# EAGLE design gatorstepper (EAGLE 7.2.0)
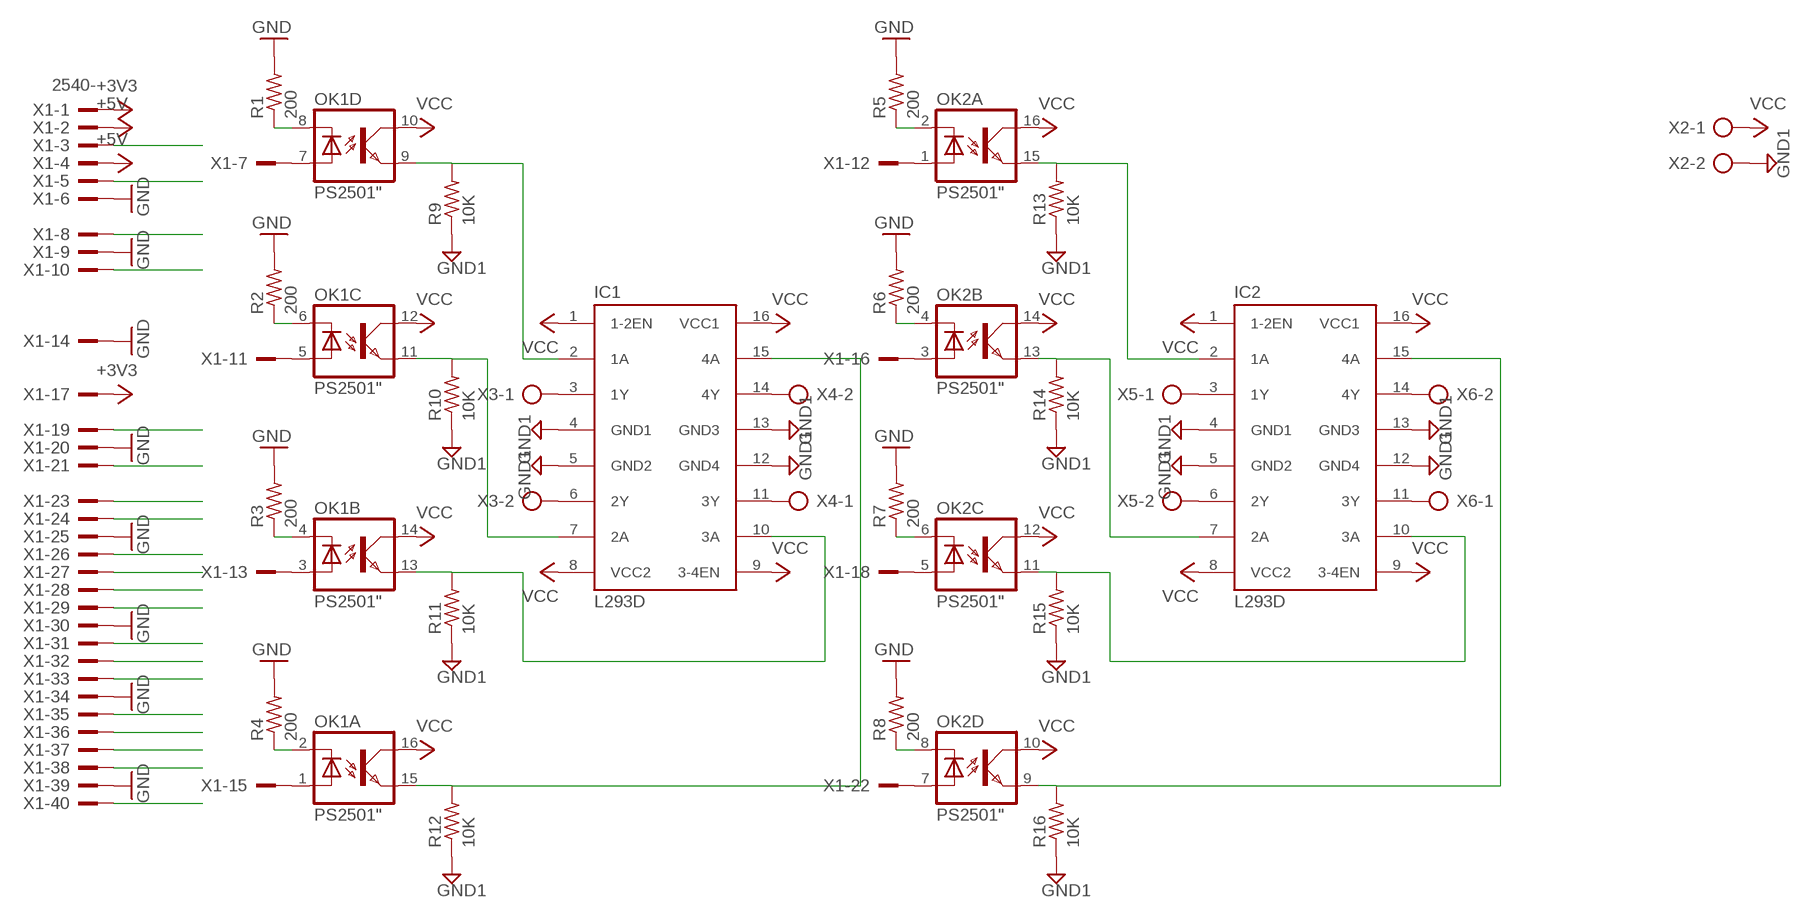
[diagram p0: schematic, sheet 1]

## Parts
IC1  L293D  [DIL16]
IC2  L293D  [DIL16]
OK1  PS2501"  [DIL16]
OK2  PS2501"  [DIL16]
R1  200  R-US_0207/12  [0207/12]
R2  200  R-US_0207/12  [0207/12]
R3  200  R-US_0207/12  [0207/12]
R4  200  R-US_0207/12  [0207/12]
R5  200  R-US_0207/12  [0207/12]
R6  200  R-US_0207/12  [0207/12]
R7  200  R-US_0207/12  [0207/12]
R8  200  R-US_0207/12  [0207/12]
R9  10K  R-US_0207/12  [0207/12]
R10  10K  R-US_0207/12  [0207/12]
R11  10K  R-US_0207/12  [0207/12]
R12  10K  R-US_0207/12  [0207/12]
R13  10K  R-US_0207/12  [0207/12]
R14  10K  R-US_0207/12  [0207/12]
R15  10K  R-US_0207/12  [0207/12]
R16  10K  R-US_0207/12  [0207/12]
X1  2540-  [PAK100/2500-40]
X2  AK300/2  [AK300/2]
X3  AK300/2  [AK300/2]
X4  AK300/2  [AK300/2]
X5  AK300/2  [AK300/2]
X6  AK300/2  [AK300/2]

## Nets
+3V3: X1.1 X1.17
+5V: X1.2 X1.4
GND: R1.2 R2.2 R3.2 R4.2 R5.2 R6.2 R7.2 R8.2 X1.6 X1.9 X1.14 X1.20 X1.25 X1.30 X1.34 X1.39
GND1: IC1.4(GND1) IC1.5(GND2) IC1.12(GND4) IC1.13(GND3) IC2.4(GND1) IC2.5(GND2) IC2.12(GND4) IC2.13(GND3) R9.1 R10.1 R11.1 R12.1 R13.1 R14.1 R15.1 R16.1 X2.2
GPIO5: X1.29
GPIO6: X1.31
GPIO12: X1.32
GPIO13: X1.33
GPIO16: X1.36
GPIO19: X1.35
GPIO20: X1.38
GPIO21: X1.40
GPIO26: X1.37
N$1: OK1.8(D:C) R1.1
N$2: OK1.6(C:C) R2.1
N$3: OK1.4(B:C) R3.1
N$4: OK1.2(A:C) R4.1
N$5: OK2.2(A:C) R5.1
N$6: OK2.4(B:C) R6.1
N$7: OK2.6(C:C) R7.1
N$8: OK2.8(D:C) R8.1
N$9: X1.3
N$10: X1.5
N$11: X1.8
N$12: X1.10
N$13: X1.19
N$14: X1.21
N$15: X1.23
N$16: X1.24
N$17: X1.26
N$18: X1.27
N$19: X1.28
N$20: IC1.2(1A) OK1.9(D:EMI) R9.2
N$21: IC1.7(2A) OK1.11(C:EMI) R10.2
N$22: IC1.10(3A) OK1.13(B:EMI) R11.2
N$23: IC1.15(4A) OK1.15(A:EMI) R12.2
N$24: IC2.2(1A) OK2.15(A:EMI) R13.2
N$25: IC2.7(2A) OK2.13(B:EMI) R14.2
N$26: IC2.10(3A) OK2.11(C:EMI) R15.2
N$27: IC2.15(4A) OK2.9(D:EMI) R16.2
N$28: IC1.3(1Y) X3.1
N$29: IC1.6(2Y) X3.2
N$30: IC1.14(4Y) X4.2
N$31: IC1.11(3Y) X4.1
N$32: IC2.3(1Y) X5.1
N$33: IC2.6(2Y) X5.2
N$34: IC2.11(3Y) X6.1
N$35: IC2.14(4Y) X6.2
N$36: OK1.1(A:A) X1.15
N$37: OK2.1(A:A) X1.12
N$38: OK2.3(B:A) X1.16
N$39: OK2.5(C:A) X1.18
N$40: OK2.7(D:A) X1.22
N$41: OK1.3(B:A) X1.13
N$42: OK1.5(C:A) X1.11
N$43: OK1.7(D:A) X1.7
VCC: IC1.1(1-2EN) IC1.8(VCC2) IC1.9(3-4EN) IC1.16(VCC1) IC2.1(1-2EN) IC2.8(VCC2) IC2.9(3-4EN) IC2.16(VCC1) OK1.10(D:COL) OK1.12(C:COL) OK1.14(B:COL) OK1.16(A:COL) OK2.10(D:COL) OK2.12(C:COL) OK2.14(B:COL) OK2.16(A:COL) X2.1

## Library data of the parts
IC1 IC2 = st-microelectronics:L293D: PUSH-PULL 4 CHANNEL DRIVER; MPN: L293D; OC_FARNELL: 9589619; OC_NEWARK: 56P8249
OK1 OK2 = optocoupler:PS2501: SHARP OPTO COUPLER
R1-R16 = resistor:R-US_: RESISTOR, American symbol
X1 = con-3m:2540-: 3M (TM) Pak 100 4-Wall Header Source: 3M; OC_FARNELL: unknown; OC_NEWARK: unknown
X2-X6 = con-ptr500:AK300/2: CONNECTOR; OC_FARNELL: unknown; OC_NEWARK: unknown

## Board
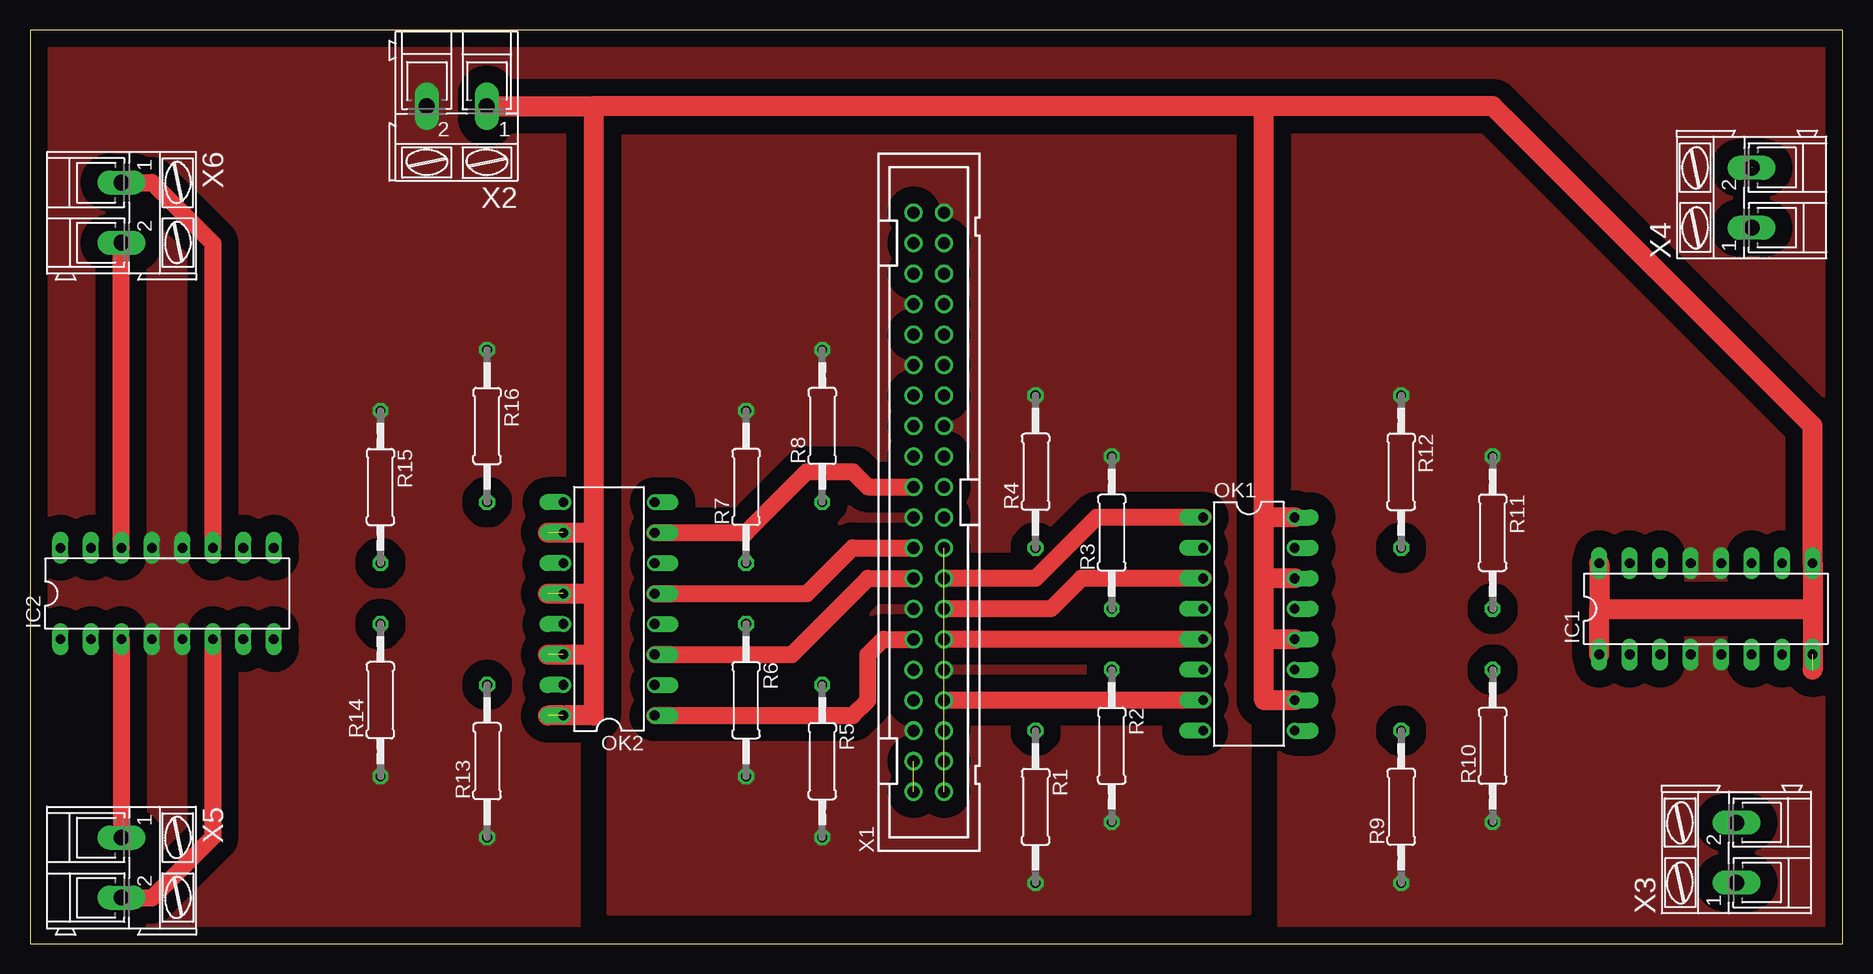
[diagram p1: board, top side]
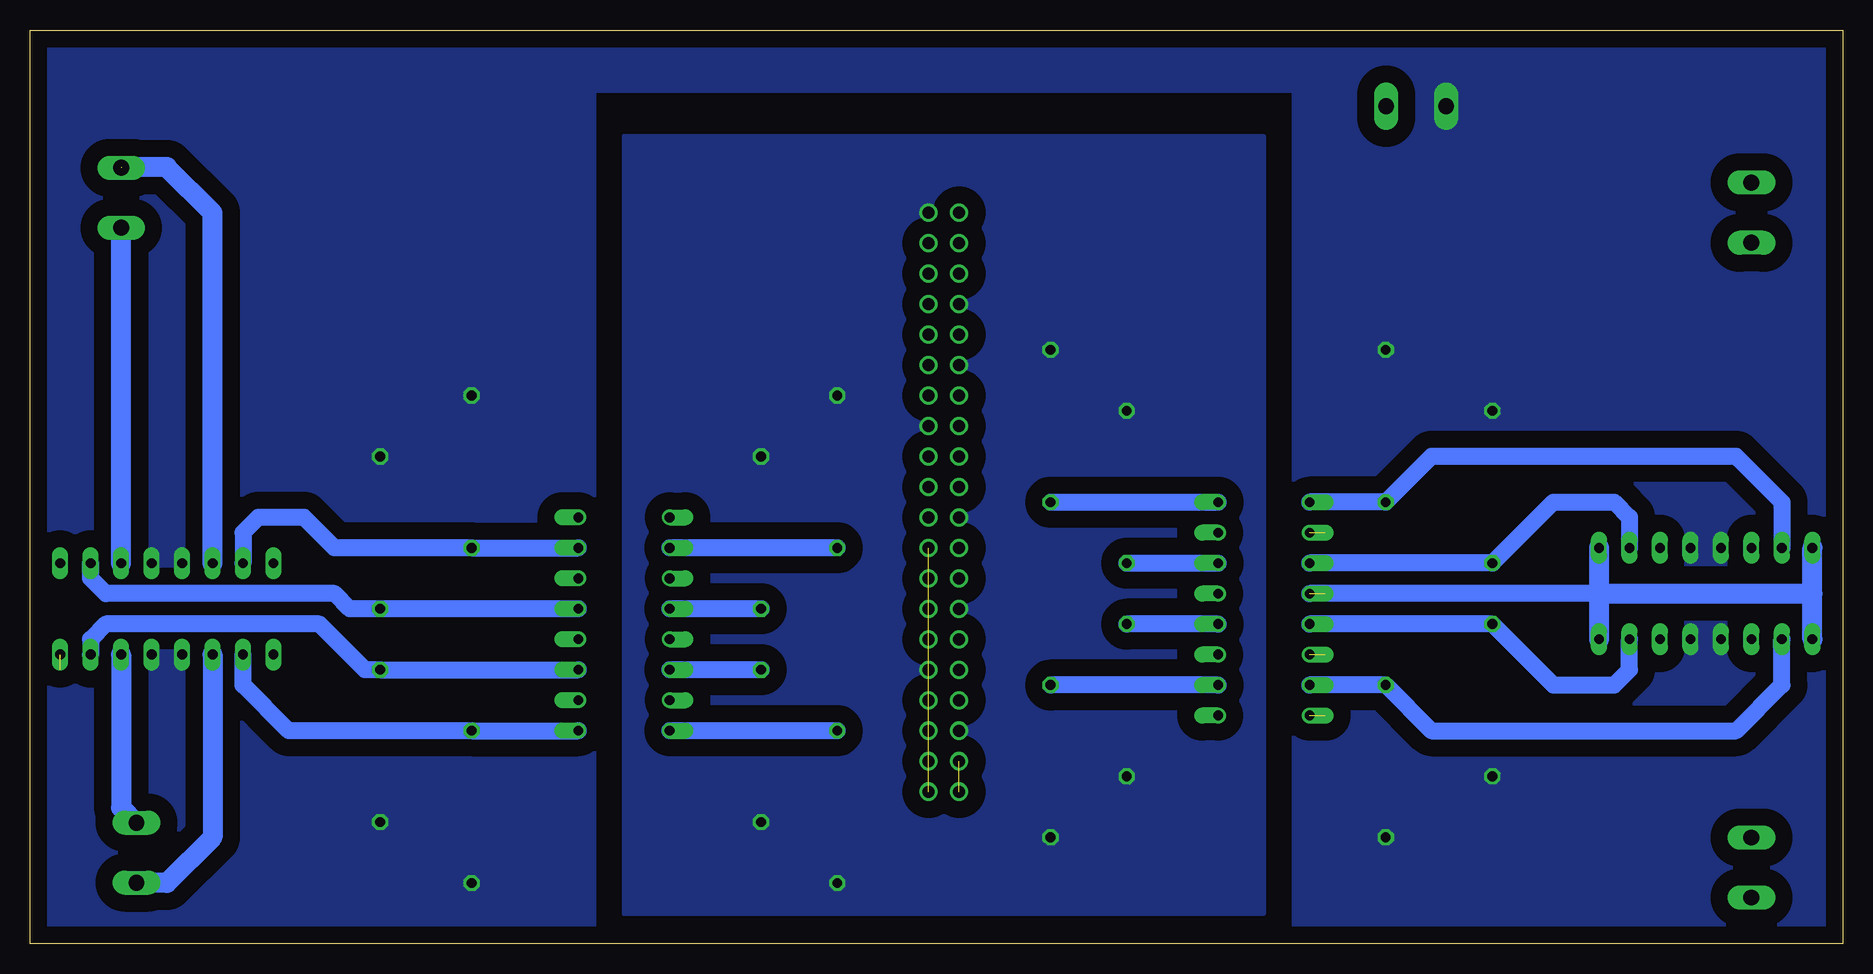
[diagram p2: board, bottom side, seen from below]

Size 151.11 x 76.2 mm. Coordinates in mm from the lower left corner, seen from the top.
Outline: 0,0 151.11,0 151.11,76.2 0,76.2 0,0
Copper layers (1*16): Top 0.035mm / dielectric 1.5mm / Bottom 0.035mm
Design rules "default": minimum track width 10mil, minimum drill 24mil, track to track 8mil, track to pad 8mil, pad to pad 8mil, via to via 8mil, smd to smd 8mil, copper to edge 40mil, drill to drill 8mil, minimum pad ring 10mil, minimum via ring 8mil, stop-mask expansion 4mil, vias tented up to drill 0mil, thermal gap 10mil

### Footprints (pad centres in the part's own frame; a part is rotated, then mirrored left to right if it is on the bottom)
DIL16 = drill 0.813 long: 1 -8.89,-3.81; 2 -6.35,-3.81; 3 -3.81,-3.81; 4 -1.27,-3.81; 5 1.27,-3.81; 6 3.81,-3.81; 7 6.35,-3.81; 8 8.89,-3.81; 9 8.89,3.81; 10 6.35,3.81; 11 3.81,3.81; 12 1.27,3.81; 13 -1.27,3.81; 14 -3.81,3.81; 15 -6.35,3.81; 16 -8.89,3.81
DIL16' = drill 0.813 offset: 1 -8.89,-3.81; 2 -6.35,-3.81; 3 -3.81,-3.81; 4 -1.27,-3.81; 5 1.27,-3.81; 6 3.81,-3.81; 7 6.35,-3.81; 8 8.89,-3.81; 9 8.89,3.81; 10 6.35,3.81; 11 3.81,3.81; 12 1.27,3.81; 13 -1.27,3.81; 14 -3.81,3.81; 15 -6.35,3.81; 16 -8.89,3.81
0207/12 = drill 0.813 octagon: 1 -6.35,0; 2 6.35,0
PAK100/2500-40 = drill 1 pad 1.422: 1 -24.13,-1.27; 2 -24.13,1.27; 3 -21.59,-1.27; 4 -21.59,1.27; 5 -19.05,-1.27; 6 -19.05,1.27; 7 -16.51,-1.27; 8 -16.51,1.27; 9 -13.97,-1.27; 10 -13.97,1.27; 11 -11.43,-1.27; 12 -11.43,1.27; 13 -8.89,-1.27; 14 -8.89,1.27; 15 -6.35,-1.27; 16 -6.35,1.27; 17 -3.81,-1.27; 18 -3.81,1.27; 19 -1.27,-1.27; 20 -1.27,1.27; 21 1.27,-1.27; 22 1.27,1.27; 23 3.81,-1.27; 24 3.81,1.27; 25 6.35,-1.27; 26 6.35,1.27; 27 8.89,-1.27; 28 8.89,1.27; 29 11.43,-1.27; 30 11.43,1.27; 31 13.97,-1.27; 32 13.97,1.27; 33 16.51,-1.27; 34 16.51,1.27; 35 19.05,-1.27; 36 19.05,1.27; 37 21.59,-1.27; 38 21.59,1.27; 39 24.13,-1.27; 40 24.13,1.27
AK300/2 = drill 1.321 long: 1 -2.515,0; 2 2.489,0

### Placement (x,y rotation side)
IC1  139.7,27.94 0 top
IC2  11.43,29.21 0 top
OK1  PS2501"  [DIL16']  101.6,26.67 270 top
OK2  PS2501"  [DIL16']  48.26,27.94 90 top
R1  83.82,11.43 270 top
R2  90.17,16.51 270 top
R3  90.17,34.29 90 top
R4  83.82,39.37 90 top
R5  66.04,15.24 270 top
R6  59.69,20.32 270 top
R7  59.69,38.1 90 top
R8  66.04,43.18 90 top
R9  114.3,11.43 90 top
R10  121.92,16.51 90 top
R11  121.92,34.29 270 top
R12  114.3,39.37 270 top
R13  38.1,15.24 90 top
R14  29.21,20.32 90 top
R15  29.21,38.1 270 top
R16  38.1,43.18 270 top
X1  74.93,36.83 90 top
X2  35.56,69.85 180 top
X3  142.24,7.62 90 top
X4  143.51,62.23 90 top
X5  7.62,6.35 270 top
X6  7.62,60.96 270 top

### Tracks (layer width: path | path; a pad name or v marks a point on that pad's centre or on a via)
+3V3  (1 unrouted)
+5V  (1 unrouted)
GND
  pour Bottom (isolate 1.422, no thermals): 48.26,67.31 101.6,67.31 101.6,2.54 48.26,2.54
  pour Top (isolate 1.422, no thermals): 48.26,67.31 101.6,67.31 101.6,2.54 48.26,2.54
GND1
  pour Bottom (isolate 1.422, no thermals): 0,76.2 0,0 45.72,0 45.72,71.12 104.14,71.12 104.14,0 151.13,0 151.13,76.2
  pour Top (isolate 1.422, no thermals): 0,0 45.72,0 45.72,68.58 104.14,68.58 104.14,0 151.13,0 151.13,76.2 0,76.2
N$1
  Bottom 1.422: R1.1 OK1.8
N$2
  Bottom 1.422: R2.1 OK1.6
N$3
  Bottom 1.422: R3.1 OK1.4
N$4
  Bottom 1.422: R4.1 OK1.2
N$5
  Bottom 1.422: OK2.2 R5.1
N$6
  Bottom 1.422: OK2.4 R6.1
N$7
  Bottom 1.422: R7.1 OK2.6
N$8
  Bottom 1.422: R8.1 OK2.8
N$20
  Bottom 1.422: OK1.9 R9.2 129.54,17.78 133.35,21.59 IC1.2
N$21
  Bottom 1.422: OK1.11 R10.2 123.19,22.86 127,26.67 144.78,26.67 146.05,25.4 IC1.7
N$22
  Bottom 1.422: OK1.13 R11.2 124.46,27.94 125.73,29.21 144.78,29.21 146.05,30.48 IC1.10
N$23
  Bottom 1.422: OK1.15 R12.2 125.73,33.02 128.27,35.56 132.08,35.56 133.35,34.29 IC1.15
N$24
  Bottom 1.422: OK2.15 R13.2 34.29,17.78 8.89,17.78 5.08,21.59 IC2.2
N$25
  Bottom 1.422: OK2.13 R14.2 24.13,21.59 19.05,21.59 17.78,22.86 IC2.7
N$26
  Bottom 1.422: OK2.11 R15.2 24.13,36.83 19.05,36.83 17.78,35.56 IC2.10
N$27
  Bottom 1.422: OK2.9 R16.2 34.29,40.64 8.89,40.64 5.08,36.83 IC2.15
N$28
  Bottom 1.676: IC1.3 135.89,8.89 139.7,5.08 142.22,5.08 X3.1
N$29
  Bottom 1.676: IC1.6 143.51,11.38 X3.2
N$30  (1 unrouted)
  Bottom 1.676: IC1.14 135.89,60.96 139.7,64.77 143.51,64.77
N$31
  Bottom 1.676: IC1.11 X4.1
N$32
  Top 1.422: IC2.3 X5.1
N$33
  Top 1.422: IC2.6 15.24,8.89 10.16,3.81 7.67,3.81 X5.2
N$34
  Top 1.422: X6.1 10.19,63.48 15.24,58.42 IC2.11
N$35
  Top 1.422: IC2.14 X6.2
N$36
  Top 1.422: OK1.1 88.9,35.56 83.82,30.48 X1.15
N$37
  Top 1.422: OK2.1 68.58,19.05 69.85,20.32 69.85,24.13 71.12,25.4 X1.12
N$38
  Top 1.422: OK2.3 63.5,24.13 69.85,30.48 X1.16
N$39
  Top 1.422: OK2.5 64.77,29.21 68.58,33.02 X1.18
N$40
  Top 1.422: OK2.7 59.69,34.29 64.77,39.37 68.58,39.37 69.85,38.1 X1.22
N$41
  Top 1.422: OK1.3 87.63,30.48 85.09,27.94 X1.13
N$42
  Top 1.422: OK1.5 X1.11
N$43
  Top 1.422: OK1.7 X1.7
VCC  (5 unrouted)
  Top 1.676: X2.1 46.99,69.85 | 102.87,69.85 46.99,69.85 | 46.99,69.85 46.99,34.29 | 43.18,34.29 46.99,34.29 | 46.99,34.29 46.99,29.21 | 43.18,29.21 46.99,29.21 | 46.99,29.21 46.99,24.13 | 43.18,24.13 46.99,24.13 | 46.99,24.13 46.99,19.05 43.18,19.05 | OK1.16 102.87,35.56 | 102.87,35.56 102.87,69.85 | OK1.14 102.87,30.48 | 102.87,30.48 102.87,35.56 | OK1.12 102.87,25.4 | 102.87,25.4 102.87,30.48 | OK1.10 102.87,20.32 102.87,25.4 | 148.59,27.94 IC1.9 148.59,43.18 121.92,69.85 102.87,69.85 | 148.59,27.94 148.59,22.86 | IC1.1 130.81,27.94 | IC1.16 130.81,27.94 | 130.81,27.94 148.59,27.94
  Bottom 1.422: 20.32,29.21 OK2.12
  Bottom 1.676: IC2.1 2.54,29.21 | 2.54,29.21 IC2.16 | 20.32,29.21 IC2.8 | IC2.9 20.32,29.21 | 20.32,29.21 2.54,29.21